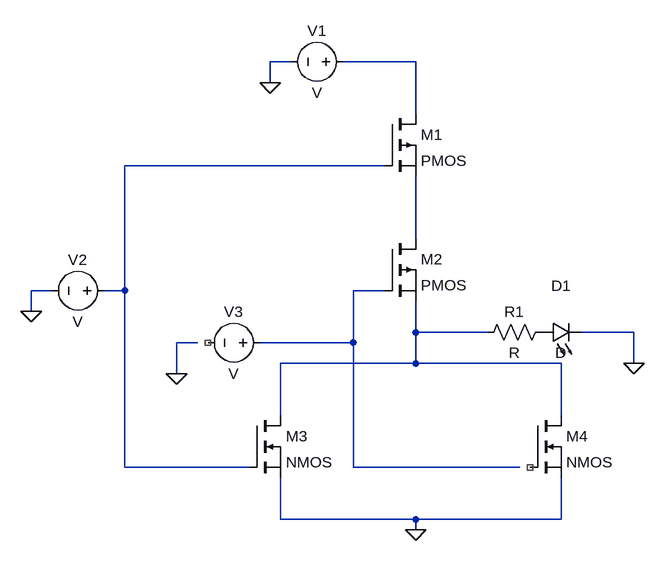
[diagram p0: schematic CMOS_NOR_Gate.asc]
CMOS_NOR_Gate.asc, the LTspice schematic file:
Version 4
SHEET 1 880 708
WIRE 0 -32 -32 -32
WIRE 192 -32 80 -32
WIRE -32 0 -32 -32
WIRE 192 48 192 -32
WIRE 144 128 -256 128
WIRE 192 240 192 144
WIRE -368 320 -400 320
WIRE -256 320 -256 128
WIRE -256 320 -288 320
WIRE 144 320 96 320
WIRE -400 352 -400 320
WIRE 192 384 192 336
WIRE 304 384 192 384
WIRE 528 384 448 384
WIRE -144 400 -176 400
WIRE 96 400 96 320
WIRE 96 400 -48 400
WIRE 192 432 192 384
WIRE 192 432 -16 432
WIRE 416 432 192 432
WIRE 528 432 528 384
WIRE -176 448 -176 400
WIRE -16 512 -16 432
WIRE 416 512 416 432
WIRE -256 592 -256 320
WIRE -64 592 -256 592
WIRE 96 592 96 400
WIRE 352 592 96 592
WIRE -16 672 -16 608
WIRE 192 672 -16 672
WIRE 416 672 416 608
WIRE 416 672 192 672
WIRE 192 688 192 672
FLAG -32 0 0
FLAG -400 352 0
FLAG 192 688 0
FLAG -176 448 0
FLAG 528 432 0
SYMBOL pmos 144 48 R0
SYMATTR InstName M1
SYMBOL pmos 144 240 R0
SYMATTR InstName M2
SYMBOL nmos -64 512 R0
SYMATTR InstName M3
SYMBOL nmos 368 512 R0
SYMATTR InstName M4
SYMBOL voltage 96 -32 R90
WINDOW 0 -32 56 VBottom 2
WINDOW 3 32 56 VTop 2
SYMATTR InstName V1
SYMBOL voltage -272 320 R90
WINDOW 0 -32 56 VBottom 2
WINDOW 3 32 56 VTop 2
SYMATTR InstName V2
SYMBOL voltage -32 400 R90
WINDOW 0 -32 56 VBottom 2
WINDOW 3 32 56 VTop 2
SYMATTR InstName V3
SYMBOL res 400 368 R90
WINDOW 0 0 56 VBottom 2
WINDOW 3 32 56 VTop 2
SYMATTR InstName R1
SYMBOL LED 384 400 R270
WINDOW 0 72 32 VTop 2
WINDOW 3 0 32 VBottom 2
SYMATTR InstName D1

The netlist it stands for:
* CMOS_NOR_Gate.asc
M1 N001 N002 N003 N003 PMOS
M2 N003 N004 N005 N005 PMOS
M3 N005 N002 0 0 NMOS
M4 N005 NC_01 0 0 NMOS
V1 N001 0 V
V2 N002 0 V
V3 N004 NC_02 V
R1 P001 N005 R
D1 P001 0 D
.model D D
.lib standard.dio
.model NMOS NMOS
.model PMOS PMOS
.lib standard.mos
.backanno
.end